# Altium project SX1262_e428v03a.PrjPCB
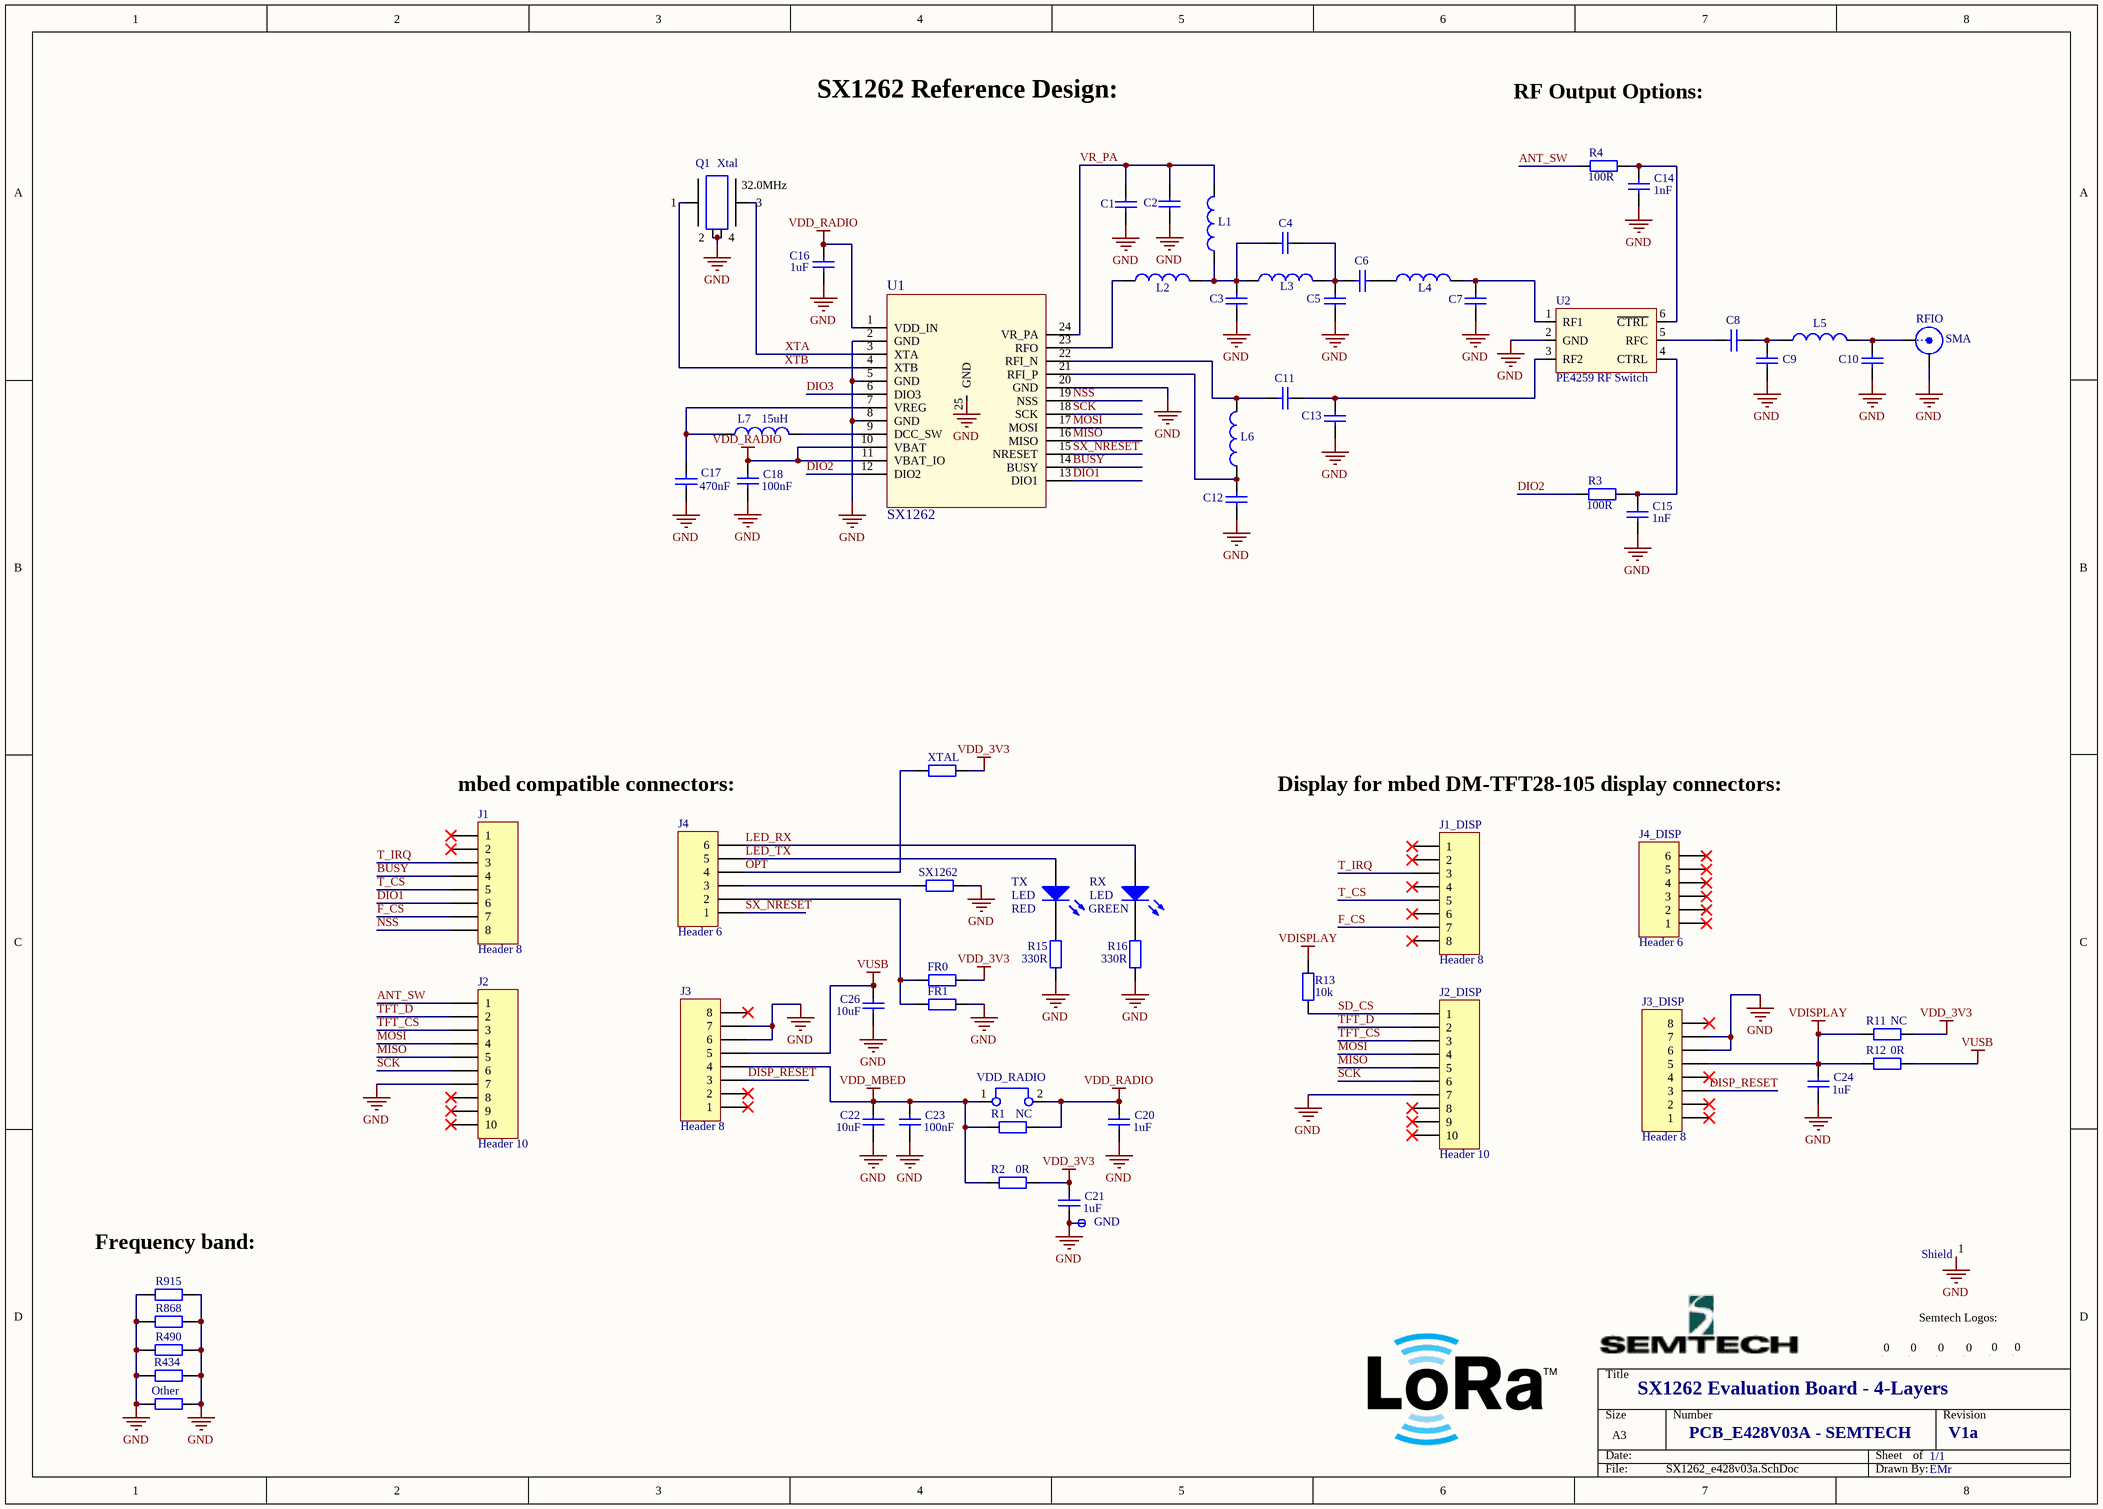
[diagram p0: SX1262_e428v03a.SchDoc]
1 sheet, 72 parts. Net scope: global (net labels, ports and power ports of the same name join across sheets).
Board file: SX1262_e428v03a.PcbDoc

## Sheet SX1262_e428v03a.SchDoc
size A3; DocumentNumber: 1; SheetNumber: 1; SheetTotal: 2

### Parts
C1  Cap  [rlc_402_smd]  (value not drawn)
C2  Cap  [rlc_402_smd]  (value not drawn)
C3  Cap  [rlc_402_smd]  (value not drawn)
C4  Cap  [rlc_402_smd]  (value not drawn)
C5  Cap  [rlc_402_smd]  (value not drawn)
C6  Cap  [rlc_402_smd]  (value not drawn)
C7  Cap  [rlc_402_smd]  (value not drawn)
C8  Cap  [rlc_402_smd]  (value not drawn)
C9  Cap  [rlc_402_smd]  (value not drawn)
C10  Cap  [rlc_402_smd]  (value not drawn)
C11  Cap  [rlc_402_smd]  (value not drawn)
C12  Cap  [rlc_402_smd]  (value not drawn)
C13  Cap  [rlc_402_smd]  (value not drawn)
C14  value 1nF  [rlc_402_smd]  (hidden comment: Cap)
C15  value 1nF  [rlc_402_smd]  (hidden comment: Cap)
C16  value 1uF  [rlc_402_smd]  (hidden comment: Cap)
C17  value 470nF  [rlc_402_smd]  (hidden comment: Cap)
C18  value 100nF  [rlc_402_smd]  (hidden comment: Cap)
C20  value 1uF  [rlc_603_smd]  (hidden comment: Cap)
C21  value 1uF  [rlc_603_smd]  (hidden comment: Cap)
C22  value 10uF  [rlc_805_smd]  (hidden comment: Cap)
C23  value 100nF  [rlc_402_smd]  (hidden comment: Cap)
C24  value 1uF  [rlc_402_smd]  (hidden comment: Cap)
C26  value 10uF  [rlc_805_smd]  (hidden comment: Cap)
FR0  Resistor  [rlc_402_smd]  (value not drawn)
FR1  Resistor  [rlc_402_smd]  (value not drawn)
GND  Test Pin  [pin_0.9mm]  (value not drawn)
J1  Header 8  [HDR1X8]
J1_DISP  Header 8  [HDR1X8]
J2  Header 10  [HDR1X10]
J2_DISP  Header 10  [HDR1X10]
J3  Header 8  [HDR1X8]
J3_DISP  Header 8  [HDR1X8]
J4  Header 6  [HDR1X6]
J4_DISP  Header 6  [HDR1X6]
L1  Inductor  [rlc_402_smd]  (value not drawn)
L2  Inductor  [rlc_402_smd]  (value not drawn)
L3  Inductor  [rlc_402_smd]  (value not drawn)
L4  Inductor  [rlc_402_smd]  (value not drawn)
L5  Inductor  [rlc_402_smd]  (value not drawn)
L6  Inductor  [rlc_402_smd]  (value not drawn)
L7  value 15uH  [rlc_805_smd enlarged]  (hidden comment: Inductor)
Logo_Bot  Logo symbol  [logo_semtech_horiz_size4]  (value not drawn)
Logo_ESD  Logo symbol  [Logo ESD]  (value not drawn)
Logo_LoRA1  Logo symbol  [Logo LoRa Size4]  (value not drawn)
Logo_LoRA2  Logo symbol  [Logo LoRa Size3]  (value not drawn)
Logo_Recycling1  Logo symbol  [Logo Recycling1]  (value not drawn)
Logo_Semtech_S  Logo symbol  [logo_semtech_horiz_size3]  (value not drawn)
Other  Resistor  [rlc_402_smd]  (value not drawn)
Q1  Xtal  value 32.0MHz  [nd2016da]
R1  value NC  [rlc_603_smd]  (hidden comment: Resistor)
R2  value 0R  [rlc_603_smd]  (hidden comment: Resistor)
R3  value 100R  [rlc_402_smd]  (hidden comment: Resistor)
R4  value 100R  [rlc_402_smd]  (hidden comment: Resistor)
R11  value NC  [rlc_402_smd]  (hidden comment: Resistor)
R12  value 0R  [rlc_402_smd]  (hidden comment: Resistor)
R13  value 10k  [rlc_402_smd]  (hidden comment: Resistor)
R15  value 330R  [rlc_402_smd]  (hidden comment: Resistor)
R16  value 330R  [rlc_402_smd]  (hidden comment: Resistor)
R434  Resistor  [rlc_402_smd]  (value not drawn)
R490  Resistor  [rlc_402_smd]  (value not drawn)
R868  Resistor  [rlc_402_smd]  (value not drawn)
R915  Resistor  [rlc_402_smd]  (value not drawn)
RFIO  SMA  [SMA_end_launch_1.0mm_9.52mm]
RX  LED  value GREEN  [LGM676 LED]
Shield  Logo symbol  [BMIS-209-F - Shield - Solder_Mask]  (value not drawn)
SX1262  Resistor  [rlc_402_smd]  (value not drawn)
TX  LED  value RED  [LGM676 LED]
U1  SX1262  [vqfn24_4x4mm]
U2  PE4259 RF Switch  [SC70-6]
VDD_RADIO  Jumper  [bridge_254mm]  (value not drawn)
XTAL  Resistor  [rlc_402_smd]  (value not drawn)

### Nets
GND: C1.1 C2.1 C3.1 C5.1 C7.1 C9.1 C10.1 C12.1 C13.1 C14.2 C15.2 C16.1 C17.1 C18.1 C20.1 C21.1 C22.1 C23.1 C24.1 C26.1 FR1.1 GND.1(pin) J2.7 J2_DISP.7 J3.6 J3.7 J3_DISP.6 J3_DISP.7 Other.1 Other.2 Q1.2 Q1.4 R15.1 R16.1 R434.1 R434.2 R490.1 R490.2 R868.1 R868.2 R915.1 R915.2 RFIO.2(GND) Shield.1 SX1262.1 U1.2(GND) U1.5(GND) U1.8(GND) U1.20(GND) U1.25(GND) U2.2(GND)
VDD_3V3: C21.2 FR0.1 R2.1 R11.1 XTAL.1
VDD_MBED: C22.2 C23.2 J3.4 R1.2 R2.2 VDD_RADIO.1
VDD_RADIO: C16.2 C18.2 C20.2 R1.1 U1.1(VDD_IN) U1.10(VBAT) U1.11(VBAT_IO) VDD_RADIO.2
VDISPLAY: C24.2 J3_DISP.5 R11.2 R12.2 R13.1
VUSB: C26.2 J3.5 R12.1
ANT_SW: J2.1 R4.2
BUSY: J1.4 U1.14(BUSY)
DIO1: J1.6 U1.13(DIO1)
DIO2: R3.2 U1.12(DIO2)
DIO3: U1.6(DIO3)
DISP_RESET: J3.3 J3_DISP.3
F_CS: J1.7 J1_DISP.7
LED_RX: J4.6 RX.1(A)
LED_TX: J4.5 TX.1(A)
MISO: J2.5 J2_DISP.5 U1.16(MISO)
MOSI: J2.4 J2_DISP.4 U1.17(MOSI)
NSS: J1.8 U1.19(NSS)
OPT: J4.4 XTAL.2
SCK: J2.6 J2_DISP.6 U1.18(SCK)
SD_CS: J2_DISP.1 R13.2
SX_NRESET: J4.1 U1.15(NRESET)
T_CS: J1.5 J1_DISP.5
T_IRQ: J1.3 J1_DISP.3
TFT_CS: J2.3 J2_DISP.3
TFT_D: J2.2 J2_DISP.2
VR_PA: C1.2 C2.2 L1.2 U1.24(VR_PA)
XTA: Q1.3 U1.3(XTA)
XTB: Q1.1 U1.4(XTB)
NetC3_2: C3.2 C4.2 L1.1 L2.2 L3.1
NetC4_1: C4.1 C5.2 C6.2 L3.2
NetC6_1: C6.1 L4.1
NetC7_2: C7.2 L4.2 U2.1(RF1)
NetC8_1: C8.1 C9.2 L5.1
NetC8_2: C8.2 U2.5(RFC)
NetC10_2: C10.2 L5.2 RFIO.1(Signal)
NetC11_1: C11.1 C13.2 U2.3(RF2)
NetC11_2: C11.2 L6.2 U1.22(RFI_N)
NetC12_2: C12.2 L6.1 U1.21(RFI_P)
NetC14_1: C14.1 R4.1 U2.6(~{CTRL})
NetC15_1: C15.1 R3.1 U2.4(CTRL)
NetC17_2: C17.2 L7.1 U1.7(VREG)
NetFR0_2: FR0.2 FR1.2 J4.2
NetJ4_3: J4.3 SX1262.2
NetL2_1: L2.1 U1.23(RFO)
NetL7_2: L7.2 U1.9(DCC_SW)
NetR15_2: R15.2 TX.2(K)
NetR16_2: R16.2 RX.2(K)

Not connected (* = marked no-connect by the designer): J1 1* 2*; J1_DISP 1* 2* 4* 6* 8*; J2 8* 9* 10*; J2_DISP 8* 9* 10*; J3 1* 2* 8*; J3_DISP 1* 2* 4* 8*; J4_DISP 1* 2* 3* 4* 5* 6*; Logo_Bot 0; Logo_ESD 0; Logo_LoRA1 0; Logo_LoRA2 0; Logo_Recycling1 0; Logo_Semtech_S 0

### Notes on the sheet
- SX1262 Reference Design:
- RF Output Options:
- mbed compatible connectors:
- Display for mbed DM-TFT28-105 display connectors:
- (near R915) Frequency band:
- Semtech Logos:
- SX1262 Evaluation Board - 4-Layers
- PCB_E428V03A - SEMTECH
- 1/1
- V1a
- EMr

### Library data of the parts
C1-C13 = Cap: Capacitor SMD; Value: NC; Published: 8-Jun-2000; LatestRevisionDate: 05-oct-2007  -  Semtech; LatestRevisionNote: Re-released for DXP Platform.; Publisher: Altium Limited
C14-C18 C20-C24 C26 = Cap: Capacitor SMD; Published: 8-Jun-2000; LatestRevisionDate: 05-oct-2007  -  Semtech; LatestRevisionNote: Re-released for DXP Platform.; Publisher: Altium Limited
FR0 XTAL = Resistor: Resistor SMD - IEC symbol version; Value: 1k; LatestRevisionDate: 27-Jul-20  -  Semtech
FR1 Other R434 R490 R868 R915 = Resistor: Resistor SMD - IEC symbol version; Value: NC; LatestRevisionDate: 27-Jul-20  -  Semtech
GND = test_pin: LatestRevisionDate: 05-oct-2007  -  Semtech
J1 J1_DISP J3 J3_DISP = Header 8: Header, 8-Pin; LatestRevisionDate: 17-Jul-2002; LatestRevisionNote: Re-released for DXP Platform.; Publisher: Altium Limited
J2 J2_DISP = Header 10: Header, 10-Pin; LatestRevisionDate: 17-Jul-2002; LatestRevisionNote: Re-released for DXP Platform.; Publisher: Altium Limited
J4 J4_DISP = Header 6: Header, 6-Pin; LatestRevisionDate: 17-Jul-2002; LatestRevisionNote: Re-released for DXP Platform.; Publisher: Altium Limited
L1-L6 = Inductor: Inductor SMD; Code_IEC: 1005; Value: 0R; Published: 8-Jun-2000; LatestRevisionDate: 05-oct-2007  -  Semtech; LatestRevisionNote: Re-released for DXP Platform.; Publisher: Altium Limited; Code_JEITA: 0402
L7 = Inductor: Inductor SMD; Code_IEC: 1005; Published: 8-Jun-2000; LatestRevisionDate: 05-oct-2007  -  Semtech; LatestRevisionNote: Re-released for DXP Platform.; Publisher: Altium Limited; Code_JEITA: 0402
Logo_Bot Logo_ESD Logo_LoRA1 Logo_LoRA2 Logo_Recycling1 Logo_Semtech_S = Logo: Schematic symbol for Logo
Q1 = Xtal GND: Crystal with GND pins; LatestRevisionDate: 05-oct-2007  -  Semtech
R1-R4 R11-R13 R15 R16 = Resistor: Resistor SMD - IEC symbol version; LatestRevisionDate: 27-Jul-20  -  Semtech
RFIO = SMA: SMA Straight Connector; LatestRevisionDate: 05-oct-2007  -  Semtech; LatestRevisionNote: Re-released for DXP Platform.; Publisher: Altium Limited
Shield = Shield: Shield - EMI Gasket - Standard Surface Mount Shields
SX1262 = Resistor: Resistor SMD - IEC symbol version; Value: 10k; LatestRevisionDate: 27-Jul-20  -  Semtech
U1 = SX126x: SX1262- Ultra low power RF transceiver
U2 = PE4259 RF Switch: PE4259 Peregrine RF Switch; LatestRevisionDate: 03-Sep-2012 -  Semtech
VDD_RADIO = Jumper: Jumper Wire; LatestRevisionDate: 05-oct-2007  -  Semtech
RX TX = LED: LatestRevisionDate: 05-oct-2007  -  Semtech